# Altium schematic sheet USB.SchDoc: Interface USB et CAN
size Letter; ApprovedBy: APPROUVÉ PAR; Organization: Cegep Limoilou; Address1: 1300, 8e Avenue; Address2: Québec, QC; Address3: Canada; Address4: G1J 5L5; SheetNumber: 7; SheetTotal: 7
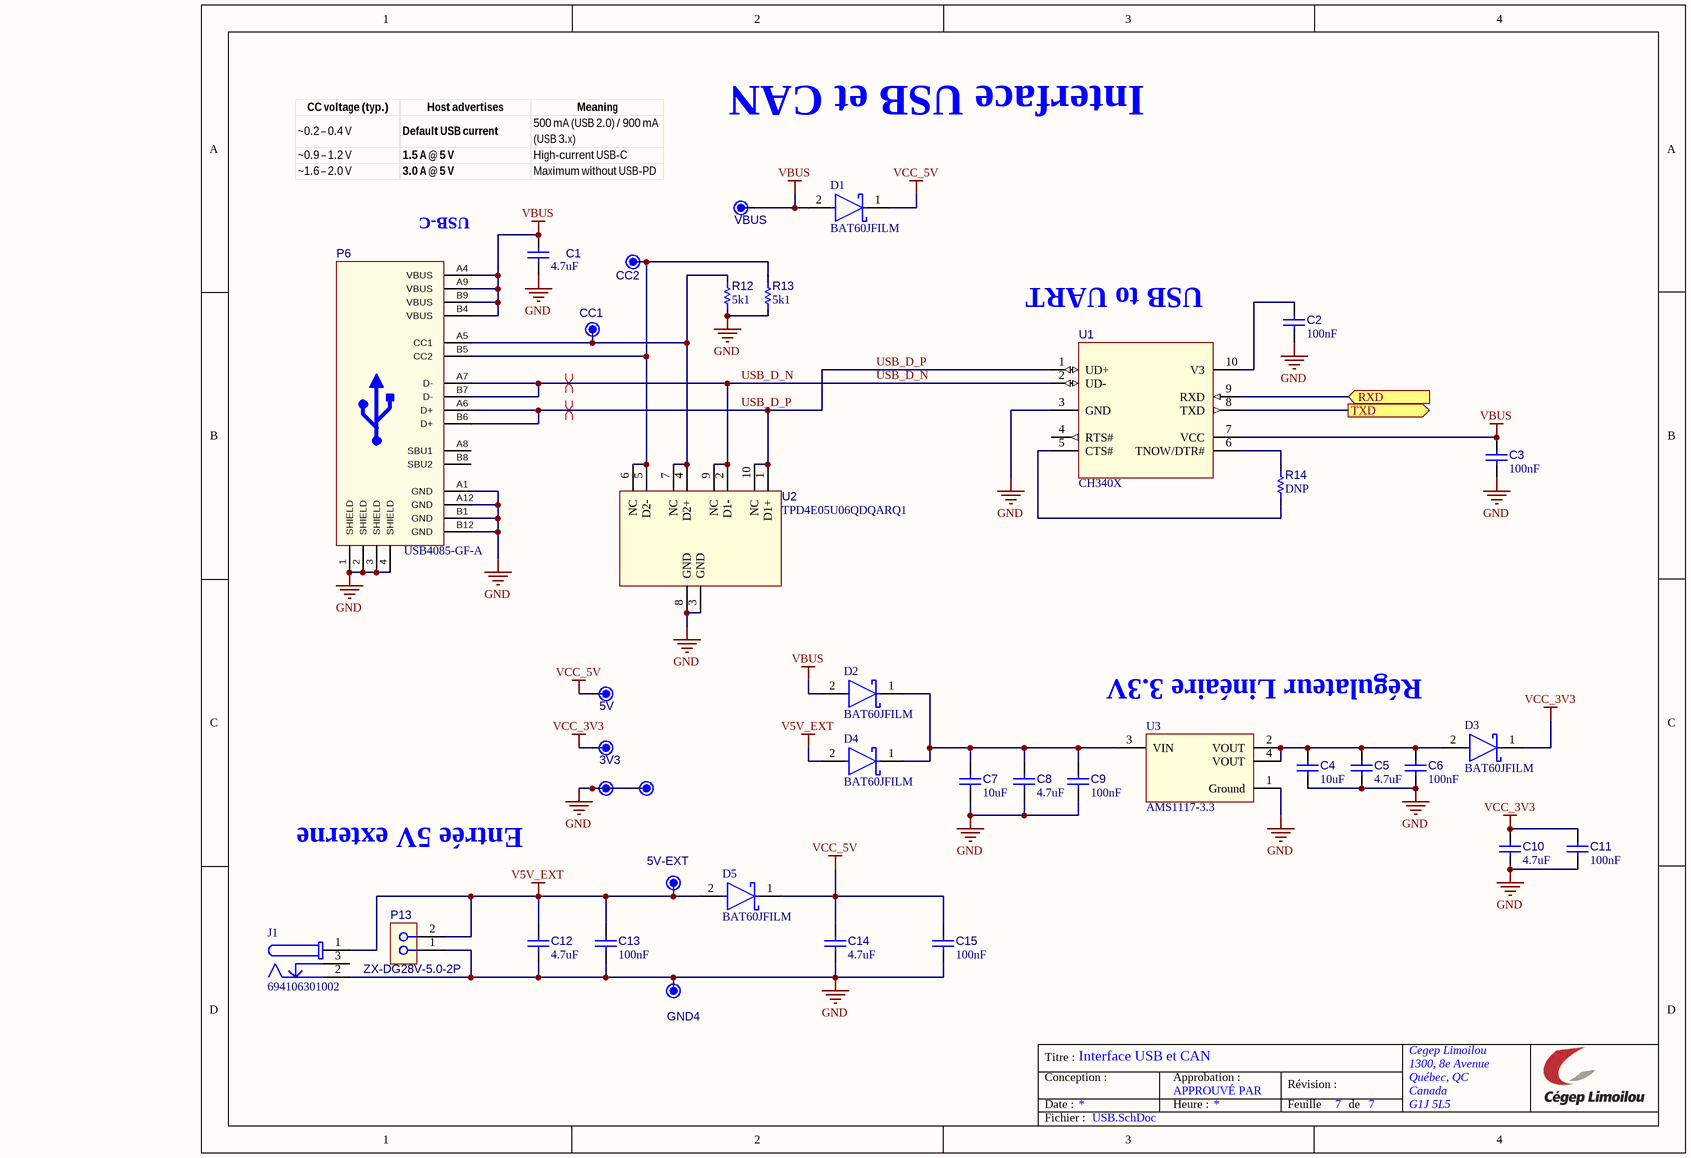
[diagram p0: USB.SchDoc]

## Parts
3V3  DNP  [TP_TH061]  (value not drawn)  (no BOM)
5V  DNP  [TP_TH061]  (value not drawn)  (no BOM)
5V-EXT  DNP  [TP_TH061]  (value not drawn)  (no BOM)
C1  value 4.7uF  [C_2012[0805]]  (hidden comment: Cap 4.7uF 0805)
C2  value 100nF  [C_1005[0402]]  (hidden comment: Cap 100nF 0402)
C3  value 100nF  [C_1005[0402]]  (hidden comment: Cap 100nF 0402)
C4  value 10uF  [C_2012[0805]]  (hidden comment: Cap 10uF 0805)
C5  value 4.7uF  [C_2012[0805]]  (hidden comment: Cap 4.7uF 0805)
C6  value 100nF  [C_1005[0402]]  (hidden comment: Cap 100nF 0402)
C7  value 10uF  [C_2012[0805]]  (hidden comment: Cap 10uF 0805)
C8  value 4.7uF  [C_2012[0805]]  (hidden comment: Cap 4.7uF 0805)
C9  value 100nF  [C_1005[0402]]  (hidden comment: Cap 100nF 0402)
C10  value 4.7uF  [C_2012[0805]]  (hidden comment: Cap 4.7uF 0805)
C11  value 100nF  [C_1005[0402]]  (hidden comment: Cap 100nF 0402)
C12  value 4.7uF  [C_2012[0805]]  (hidden comment: Cap 4.7uF 0805)
C13  value 100nF  [C_1005[0402]]  (hidden comment: Cap 100nF 0402)
C14  value 4.7uF  [C_2012[0805]]  (hidden comment: Cap 4.7uF 0805)
C15  value 100nF  [C_1005[0402]]  (hidden comment: Cap 100nF 0402)
CC1  DNP  [TP_TH061]  (value not drawn)  (no BOM)
CC2  DNP  [TP_TH061]  (value not drawn)  (no BOM)
D1  BAT60JFILM  [SOD323]
D2  BAT60JFILM  [SOD323]
D3  BAT60JFILM  [SOD323]
D4  BAT60JFILM  [SOD323]
D5  BAT60JFILM  [SOD323]
GND1  GND  [TP_TH061]  (value not drawn)  (no BOM)
GND2  GND  [TP_TH061]  (value not drawn)  (no BOM)
GND4  GND  [TP_TH061]  (value not drawn)  (no BOM)
J1  694106301002  [CONN_DC-JACK_RA]
P6  USB4085-GF-A  [FP-USB4085-GF-A-MFG]  (no BOM)
P13  ZX-DG28V-5.0-2P  [CONN_TERM_BLOCK_2POS_5mm_Model1]  (no BOM)
R12  value 5k1  [R_1005[0402]]  (hidden comment: Res 5k1 1% 0402)
R13  value 5k1  [R_1005[0402]]  (hidden comment: Res 5k1 1% 0402)
R14  value DNP  [R_1005[0402]]  (hidden comment: Res 4k7 1% 0402)  (no BOM)
U1  CH340X  [U_MSOP50P300X500-10(RM-10)_WO-TP]
U2  TPD4E05U06QDQARQ1  [U_USON50P250X100-10]
U3  AMS1117-3.3  [SOT-223]
VBUS  DNP  [TP_TH061]  (value not drawn)  (no BOM)

## Ports
RXD (in, see PCB-Support-STM32F407[3C]), TXD (out, see PCB-Support-STM32F407[3C])

## Nets
GND: C1.1 C2.1 C3.1 C4.1 C5.1 C6.1 C7.1 C8.1 C9.1 C10.1 C11.1 C12.1 C13.1 C14.1 C15.1 GND1.1 GND2.1 GND4.1 J1.2 P6.1(SHIELD) P6.2(SHIELD) P6.3(SHIELD) P6.4(SHIELD) P6.A1(GND) P6.A12(GND) P6.B1(GND) P6.B12(GND) P13.1 R12.1 R13.1 U1.3(GND) U2.3(GND) U2.8(GND) U3.1(Ground)
V5V_EXT: 5V-EXT.1 C12.2 C13.2 D4.2(A) D5.2(A) J1.1 P13.2
VBUS: C1.2 C3.2 D1.2(A) D2.2(A) P6.A4(VBUS) P6.A9(VBUS) P6.B4(VBUS) P6.B9(VBUS) U1.7(VCC) VBUS.1
VCC_3V3: 3V3.1 C10.2 C11.2 D3.1(K)
VCC_5V: 5V.1 C14.2 C15.2 D1.1(K) D5.1(K)
RXD: U1.9(RXD) ; port RXD
TXD: U1.8(TXD) ; port TXD
USB_D_N: P6.A7(D-) P6.B7(D-) U1.2(UD-) U2.2(D1-) U2.9(NC)
USB_D_P: P6.A6(D+) P6.B6(D+) U1.1(UD+) U2.1(D1+) U2.10(NC)
NetC2_2: C2.2 U1.10(V3)
NetC4_2: C4.2 C5.2 C6.2 D3.2(A) U3.2(VOUT) U3.4(VOUT)
NetC7_2: C7.2 C8.2 C9.2 D2.1(K) D4.1(K) U3.3(VIN)
NetCC1_1: CC1.1 P6.A5(CC1) R12.2 U2.4(D2+) U2.7(NC)
NetCC2_1: CC2.1 P6.B5(CC2) R13.2 U2.5(D2-) U2.6(NC)
NetR14_1: R14.1 U1.5(CTS#)
NetR14_2: R14.2 U1.6(TNOW/DTR#)

Not connected (* = marked no-connect by the designer): J1 3; P6 A8(SBU1) B8(SBU2); U1 4(RTS#)

## Layout directives
differential pair: USB_D_N, USB_D_P

## Notes on the sheet
- (near P6) USB-C
- USB to UART
- Régulateur Linéaire 3.3V
- Entrée 5V externe
- Titre :
- Conception :
- Date :
- Approbation :
- Heure :
- Révision :
- Feuille
- de
- Fichier :

## Library data of the parts
3V3 5V 5V-EXT CC1 CC2 VBUS = TP_TH0.61mm(AWG28): Pad TH 0.61mm diameter (AWG28); Value: DNP; Manufacturer Part Number 1: DNP; Supplier Part Number 1: N/A; Supplier 1: N/A
C1 C5 C8 C10 C12 C14 = CAP003: Capacitor type 1; Manufacturer 1: Taiyo Yuden; Manufacturer Part Number 1: TMK212AB7475KG-T; LibRef: CAP003; CEGEP: KCOND02SM; Tolerance: 10%; Rated Voltage: 25V; Dielectric: X7R; Supplier 1: LCSC; Supplier Part Number 1: C163186; Mounting Technology: SMT
C2 C3 C6 C9 C11 C13 C15 = CAP001: Capacitor type 1; Manufacturer 1: Taiyo Yuden; Manufacturer Part Number 1: UMK105B7104KV-FR; LibRef: CAP001; CEGEP: KCOND01SM; Tolerance: 10%; Rated Voltage: 50V; Dielectric: X7R; Mounting Technology: SMT; Supplier 1: LCSC; Supplier Part Number 1: C2167491
C4 C7 = CAP004: Capacitor type 1; Manufacturer 1: Samsung; Manufacturer Part Number 1: CL21A106KAYNNNE; LibRef: CAP004; CEGEP: KCOND03SM; Tolerance: 10%; Rated Voltage: 25V; Dielectric: X5R; Mounting Technology: SMT; Supplier 1: LCSC; Supplier Part Number 1: C15850
D1-D5 = D_BAT60: DIODE SCHOTTKY 10V 3A SOD323; Manufacturer 1: ST; Manufacturer Part Number 1: BAT60JFILM; Mounting Technology: SMT; Supplier 1: LCSC; Supplier Part Number 1: C133103
GND1 GND2 GND4 = TP_TH0.61mm(AWG28): Pad TH 0.61mm diameter (AWG28); Value: DNP; Manufacturer Part Number 1: DNP; Supplier Part Number 1: N/A; Supplier 1: N/A
J1 = CONN-DC-JACK-2MM5: DC Barrel Connector 2.5mm; Manufacturer 1: XKB Connection; Manufacturer Part Number 1: DC-005-5A-2.5; Mounting Technology: TH; Supplier 1: LCSC; Supplier Part Number 1: C381115
P6 = CONN-USB-C-16POS: CONN RCPT USB2.0 TYPE C RA - TH; Manufacturer 1: Global Connector Technology; Code CEGEP: ? (R13-B182); Manufacturer Part Number 1: USB4085-GF-A; Mounting Technology: TH; Supplier 1: LCSC; Supplier 2: Digikey; Supplier Part Number 1: C7095263; Supplier Part Number 2: 2073-USB4085-GF-ACT-ND
P13 = CONN-5MM-2POS-TERM-BLOCK: CONN TERM BLOCK 2POS 5mm pitch; Manufacturer 1: Megastar; Code CEGEP: CONWECO0002; Supplier 1: LCSC; Supplier Part Number 1: C49022995; Manufacturer Part Number 1: ZX-DG28V-5.0-2P; Mounting Technology: TH; Manufacturer 2: Weidmüller - Phoenix Contact; Manufacturer Part Number 2: 1760510000 - 1890963
R12 R13 = RES010: Resistor type 1; Manufacturer 1: Panasonic; Manufacturer Part Number 1: ERJ-2RKF5101X; LibRef: RES010; Puissance: 1/16W; Max Working Voltage: 50V; Tolerance: 1%; Supplier 1: LCSC; Supplier Part Number 1: C25905; Mounting Technology: SMT
R14 = RES007: Resistor type 1; Manufacturer 1: Panasonic; Manufacturer Part Number 1: ERJ-2RKF4701X; LibRef: RES007; Puissance: 1/16W; Max Working Voltage: 50V; Tolerance: 1%; Mounting Technology: SMT; Supplier 1: LCSC; Supplier Part Number 1: C400631
U1 = U_CH340X: IC USB to Serial Port; Manufacturer 1: WCH(Jiangsu Qin Heng); Code CEGEP: KPTSO02; Manufacturer Part Number 1: CH340X; Mounting Technology: SMT; Supplier 1: LCSC; Supplier Part Number 1: C3035748
U2 = U_TPD4E05U06: TVS DIODE 5.5V 14V 10USON; Manufacturer 1: Texas Instruments; Manufacturer 2: ElecSuper; Manufacturer Part Number 2: TPD4E05U06QDQARQ1-ES; Manufacturer Part Number 1: TPD4E05U06QDQARQ1; Mounting Technology: SMT; Supplier 1: LCSC; Supplier 2: Digikey; Supplier Part Number 1: C81353; Supplier Part Number 2: 296-40696-1-ND
U3 = U_AMS1117-3.3: LDO Voltage Regulators 1A, 3.3V; Manufacturer 1: UMW; Manufacturer Part Number 1: AMS1117-3.3; Mounting Technology: SMT; Manufacturer 2: Advanced Monolithic Systems; Manufacturer Part Number 2: AMS1117-3.3; Supplier 1: LCSC; Supplier 2: LCSC; Supplier Part Number 1: C347222; Supplier Part Number 2: C6186